# Altium schematic sheet Level Shifter V1.0.SchDoc
size A4; SheetNumber: 1; SheetTotal: 1
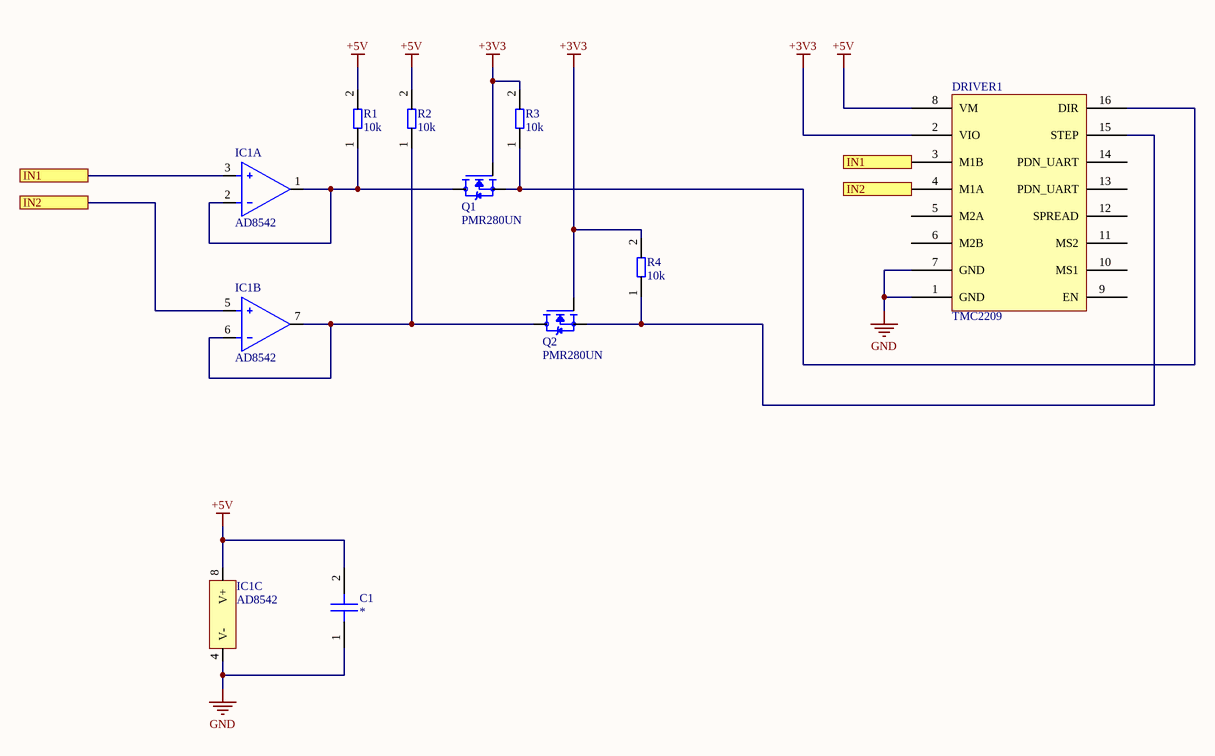
[diagram p0: Level Shifter V1.0.SchDoc]

## Parts
C1  *  [0805 Resistor - IPC A]
DRIVER1  TMC2209  [TMC2209]
IC1  AD8542  [IC_AD8542ARMZ_Analog_Devices]  (parts A,B,C of 3)
Q1  PMR280UN  [MOSFET_PMR280UN_NEXPERIA]
Q2  PMR280UN  [MOSFET_PMR280UN_NEXPERIA]
R1  10k  [0805 Resistor - IPC A]
R2  10k  [0805 Resistor - IPC A]
R3  10k  [0805 Resistor - IPC A]
R4  10k  [0805 Resistor - IPC A]

## Ports
IN1 (see Level Shifter V1.0[1B]), IN1 (see Level Shifter V1.0[3B]), IN2 (see Level Shifter V1.0[1B]), IN2 (see Level Shifter V1.0[3B])

## Nets
+3V3: DRIVER1.2(VIO) Q1.1(G) Q2.1(G) R3.2 R4.2
+5V: C1.2 DRIVER1.8(VM) IC1.8(V+) R1.2 R2.2
GND: C1.1 DRIVER1.1(GND) DRIVER1.7(GND) IC1.4(V-)
IN1: DRIVER1.3(M1B) IC1.3(V_IN_A+) ; port IN1
IN2: DRIVER1.4(M1A) IC1.5(V_IN_B+) ; port IN2
NetDRIVER1_15: DRIVER1.15(STEP) Q2.2(S) R4.1
NetDRIVER1_16: DRIVER1.16(DIR) Q1.2(S) R3.1
NetIC1_1: IC1.1(OUT_A) IC1.2(V_IN_A-) Q1.3(D) R1.1
NetIC1_6: IC1.6(V_IN_B-) IC1.7(OUT_B) Q2.3(D) R2.1

Not connected (* = marked no-connect by the designer): DRIVER1 5(M2A) 6(M2B) 9(EN) 10(MS1) 11(MS2) 12(SPREAD) 13(PDN_UART) 14(PDN_UART)

## Library data of the parts
C1 = CAP_0805_generic: Part Number: *; Value: *; Manufacturer: *; Supplier: *; Order Code: *
DRIVER1 = TMC2209: TMC2209 FET based stepper motor driver board
IC1 = IC_AD8542_ANALOG: Operational Amplifiers - Op Amps DUAL, LOW PWR RAIL/RAIL OP AMP / AD8542ARZ / SOIC-8
Q1 Q2 = MOSFET_PMR280UN_NEXPERIA
R1-R4 = RES_0805_generic: Part Number: *; Value: 10k; Manufacturer: *; Supplier: *; Order Code: *